# Altium schematic sheet VME_connectors.SchDoc: VME connectors
size 420 x 297 mm; CheckedBy: T.Janicki; Author: G.Kasprowicz; CompanyName: Creotech Instruments SA; DrawnBy: G.Kasprowicz; Organization: CERN; Address1: European Organization for Nuclear Research; Address2: CH-1211 Geneve 23 - Switzerland; Revision: -; SheetNumber: 18; SheetTotal: 21; EDA_Number: EDA-xxxx; Projet: Simple VME FMC Carrier; ModifiedBy: -; CreateDate: 26/04/2012; CheckedDate: 30/04/2012; DivGrp: BE-CO; Designer: G.Kasprowicz; PageSetup: Record=PageOptions|CenterHorizontal=True|CenterVertical=True|PrintScale=0.95|XCorrection=1.00|YCorrection=1.00|PrintKind=1|BorderSize=5000000|LeftOffset=0|BottomOffset=0|Orientation=2|PaperLength=1000|PaperWidth=1000|Scale=100|PaperSource=15|PrintQuality=600|MediaType=1|DitherType=10|PaperKind=A3|PrintScaleMode=1; ModifiedDate: -
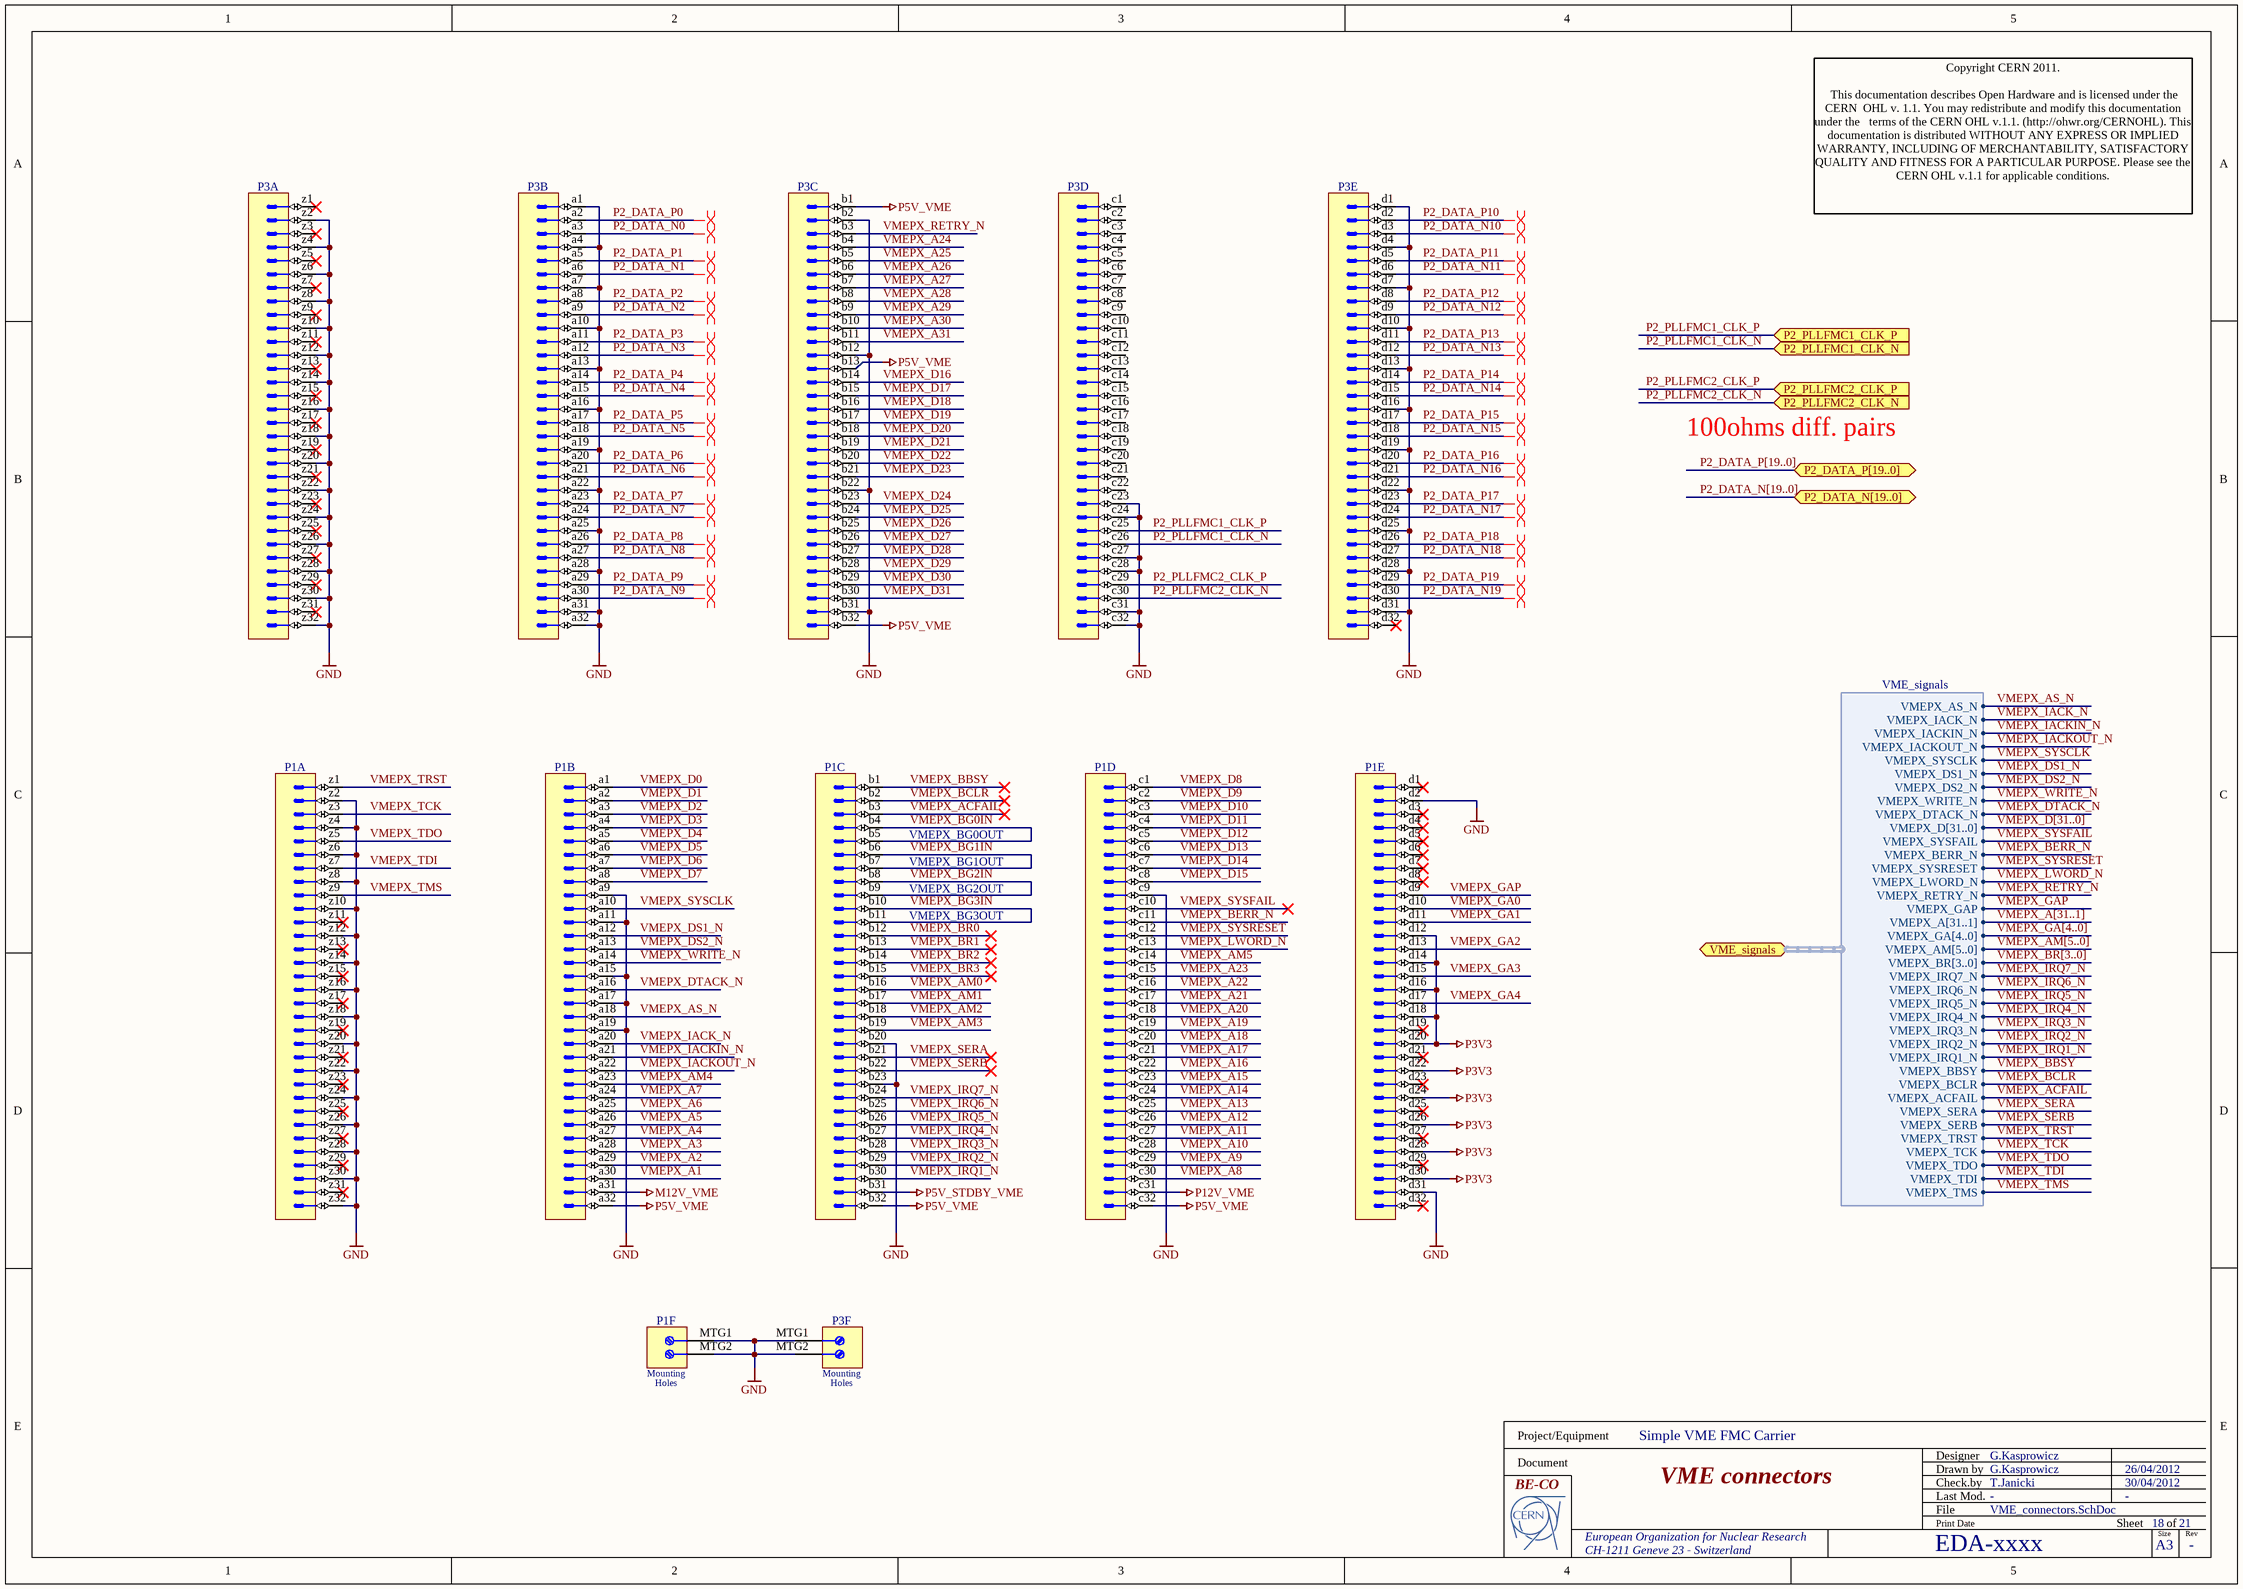
[diagram p0: VME_connectors.SchDoc]

## Parts
P1  HAR-BUS 64  [HARTING_02 01 160 2101]  (value not drawn)  (parts A,B,C,D,E,F of 6)
P3  HAR-BUS 64  [HARTING_02 01 160 2101]  (value not drawn)  (parts A,B,C,D,E,F of 6)

## Ports
P2_DATA_N[19..0] (bidir), P2_DATA_P[19..0] (bidir), P2_PLLFMC1_CLK_N (in), P2_PLLFMC1_CLK_P (in), P2_PLLFMC2_CLK_N (in), P2_PLLFMC2_CLK_P (in), VME_signals (harness VME_signals)

## Harnesses
VME_signals: VMEPX_AS_N, VMEPX_IACK_N, VMEPX_IACKIN_N, VMEPX_IACKOUT_N, VMEPX_SYSCLK, VMEPX_DS1_N, VMEPX_DS2_N, VMEPX_WRITE_N, VMEPX_DTACK_N, VMEPX_D[31..0], VMEPX_SYSFAIL, VMEPX_BERR_N, VMEPX_SYSRESET, VMEPX_LWORD_N, VMEPX_RETRY_N, VMEPX_GAP, VMEPX_A[31..1], VMEPX_GA[4..0], VMEPX_AM[5..0], VMEPX_BR[3..0], VMEPX_IRQ7_N, VMEPX_IRQ6_N, VMEPX_IRQ5_N, VMEPX_IRQ4_N, VMEPX_IRQ3_N, VMEPX_IRQ2_N, VMEPX_IRQ1_N, VMEPX_BBSY, VMEPX_BCLR, VMEPX_ACFAIL, VMEPX_SERA, VMEPX_SERB, VMEPX_TRST, VMEPX_TCK, VMEPX_TDO, VMEPX_TDI, VMEPX_TMS

## Nets
GND: P1.a9 P1.a11 P1.a15 P1.a17 P1.a19 P1.b20 P1.b23 P1.c9 P1.d2 P1.d31 P1.MTG1 P1.MTG2 P1.z2 P1.z4 P1.z6 P1.z8 P1.z10 P1.z12 P1.z14 P1.z16 P1.z18 P1.z20 P1.z22 P1.z24 P1.z26 P1.z28 P1.z30 P1.z32 P3.a1 P3.a4 P3.a7 P3.a10 P3.a13 P3.a16 P3.a19 P3.a22 P3.a25 P3.a28 P3.a31 P3.a32 P3.b2 P3.b12 P3.b22 P3.b31 P3.c23 P3.c24 P3.c27 P3.c28 P3.c31 P3.c32 P3.d1 P3.d4 P3.d7 P3.d10 P3.d13 P3.d16 P3.d19 P3.d22 P3.d25 P3.d28 P3.d31 P3.MTG1 P3.MTG2 P3.z2 P3.z4 P3.z6 P3.z8 P3.z10 P3.z12 P3.z14 P3.z16 P3.z18 P3.z20 P3.z22 P3.z24 P3.z26 P3.z28 P3.z30 P3.z32
M12V_VME: P1.a31
P3V3: P1.d12 P1.d14 P1.d16 P1.d18 P1.d20 P1.d22 P1.d24 P1.d26 P1.d28 P1.d30
P5V_STDBY_VME: P1.b31
P5V_VME: P1.a32 P1.b32 P1.c32 P3.b1 P3.b13 P3.b32
P12V_VME: P1.c31
P2_DATA_N0: P3.a3
P2_DATA_N1: P3.a6
P2_DATA_N2: P3.a9
P2_DATA_N3: P3.a12
P2_DATA_N4: P3.a15
P2_DATA_N5: P3.a18
P2_DATA_N6: P3.a21
P2_DATA_N7: P3.a24
P2_DATA_N8: P3.a27
P2_DATA_N9: P3.a30
P2_DATA_N10: P3.d3
P2_DATA_N11: P3.d6
P2_DATA_N12: P3.d9
P2_DATA_N13: P3.d12
P2_DATA_N14: P3.d15
P2_DATA_N15: P3.d18
P2_DATA_N16: P3.d21
P2_DATA_N17: P3.d24
P2_DATA_N18: P3.d27
P2_DATA_N19: P3.d30
P2_DATA_P0: P3.a2
P2_DATA_P1: P3.a5
P2_DATA_P2: P3.a8
P2_DATA_P3: P3.a11
P2_DATA_P4: P3.a14
P2_DATA_P5: P3.a17
P2_DATA_P6: P3.a20
P2_DATA_P7: P3.a23
P2_DATA_P8: P3.a26
P2_DATA_P9: P3.a29
P2_DATA_P10: P3.d2
P2_DATA_P11: P3.d5
P2_DATA_P12: P3.d8
P2_DATA_P13: P3.d11
P2_DATA_P14: P3.d14
P2_DATA_P15: P3.d17
P2_DATA_P16: P3.d20
P2_DATA_P17: P3.d23
P2_DATA_P18: P3.d26
P2_DATA_P19: P3.d29
P2_PLLFMC1_CLK_N: P3.c26 ; port P2_PLLFMC1_CLK_N
P2_PLLFMC1_CLK_P: P3.c25 ; port P2_PLLFMC1_CLK_P
P2_PLLFMC2_CLK_N: P3.c30 ; port P2_PLLFMC2_CLK_N
P2_PLLFMC2_CLK_P: P3.c29 ; port P2_PLLFMC2_CLK_P
VMEPX_A1: P1.a30
VMEPX_A2: P1.a29
VMEPX_A3: P1.a28
VMEPX_A4: P1.a27
VMEPX_A5: P1.a26
VMEPX_A6: P1.a25
VMEPX_A7: P1.a24
VMEPX_A8: P1.c30
VMEPX_A9: P1.c29
VMEPX_A10: P1.c28
VMEPX_A11: P1.c27
VMEPX_A12: P1.c26
VMEPX_A13: P1.c25
VMEPX_A14: P1.c24
VMEPX_A15: P1.c23
VMEPX_A16: P1.c22
VMEPX_A17: P1.c21
VMEPX_A18: P1.c20
VMEPX_A19: P1.c19
VMEPX_A20: P1.c18
VMEPX_A21: P1.c17
VMEPX_A22: P1.c16
VMEPX_A23: P1.c15
VMEPX_A24: P3.b4
VMEPX_A25: P3.b5
VMEPX_A26: P3.b6
VMEPX_A27: P3.b7
VMEPX_A28: P3.b8
VMEPX_A29: P3.b9
VMEPX_A30: P3.b10
VMEPX_A31: P3.b11
VMEPX_ACFAIL: P1.b3 ; port VME_signals.VMEPX_ACFAIL
VMEPX_AM0: P1.b16
VMEPX_AM1: P1.b17
VMEPX_AM2: P1.b18
VMEPX_AM3: P1.b19
VMEPX_AM4: P1.a23
VMEPX_AM5: P1.c14
VMEPX_AS_N: P1.a18 ; port VME_signals.VMEPX_AS_N
VMEPX_BBSY: P1.b1 ; port VME_signals.VMEPX_BBSY
VMEPX_BCLR: P1.b2 ; port VME_signals.VMEPX_BCLR
VMEPX_BERR_N: P1.c11 ; port VME_signals.VMEPX_BERR_N
VMEPX_BG0IN: P1.b4 P1.b5
VMEPX_BG1IN: P1.b6 P1.b7
VMEPX_BG2IN: P1.b8 P1.b9
VMEPX_BG3IN: P1.b10 P1.b11
VMEPX_BR0: P1.b12
VMEPX_BR1: P1.b13
VMEPX_BR2: P1.b14
VMEPX_BR3: P1.b15
VMEPX_D0: P1.a1
VMEPX_D1: P1.a2
VMEPX_D2: P1.a3
VMEPX_D3: P1.a4
VMEPX_D4: P1.a5
VMEPX_D5: P1.a6
VMEPX_D6: P1.a7
VMEPX_D7: P1.a8
VMEPX_D8: P1.c1
VMEPX_D9: P1.c2
VMEPX_D10: P1.c3
VMEPX_D11: P1.c4
VMEPX_D12: P1.c5
VMEPX_D13: P1.c6
VMEPX_D14: P1.c7
VMEPX_D15: P1.c8
VMEPX_D16: P3.b14
VMEPX_D17: P3.b15
VMEPX_D18: P3.b16
VMEPX_D19: P3.b17
VMEPX_D20: P3.b18
VMEPX_D21: P3.b19
VMEPX_D22: P3.b20
VMEPX_D23: P3.b21
VMEPX_D24: P3.b23
VMEPX_D25: P3.b24
VMEPX_D26: P3.b25
VMEPX_D27: P3.b26
VMEPX_D28: P3.b27
VMEPX_D29: P3.b28
VMEPX_D30: P3.b29
VMEPX_D31: P3.b30
VMEPX_DS1_N: P1.a12 ; port VME_signals.VMEPX_DS1_N
VMEPX_DS2_N: P1.a13 ; port VME_signals.VMEPX_DS2_N
VMEPX_DTACK_N: P1.a16 ; port VME_signals.VMEPX_DTACK_N
VMEPX_GA0: P1.d10
VMEPX_GA1: P1.d11
VMEPX_GA2: P1.d13
VMEPX_GA3: P1.d15
VMEPX_GA4: P1.d17
VMEPX_GAP: P1.d9 ; port VME_signals.VMEPX_GAP
VMEPX_IACK_N: P1.a20 ; port VME_signals.VMEPX_IACK_N
VMEPX_IACKIN_N: P1.a21 ; port VME_signals.VMEPX_IACKIN_N
VMEPX_IACKOUT_N: P1.a22 ; port VME_signals.VMEPX_IACKOUT_N
VMEPX_IRQ1_N: P1.b30 ; port VME_signals.VMEPX_IRQ1_N
VMEPX_IRQ2_N: P1.b29 ; port VME_signals.VMEPX_IRQ2_N
VMEPX_IRQ3_N: P1.b28 ; port VME_signals.VMEPX_IRQ3_N
VMEPX_IRQ4_N: P1.b27 ; port VME_signals.VMEPX_IRQ4_N
VMEPX_IRQ5_N: P1.b26 ; port VME_signals.VMEPX_IRQ5_N
VMEPX_IRQ6_N: P1.b25 ; port VME_signals.VMEPX_IRQ6_N
VMEPX_IRQ7_N: P1.b24 ; port VME_signals.VMEPX_IRQ7_N
VMEPX_LWORD_N: P1.c13 ; port VME_signals.VMEPX_LWORD_N
VMEPX_RETRY_N: P3.b3 ; port VME_signals.VMEPX_RETRY_N
VMEPX_SERA: P1.b21 ; port VME_signals.VMEPX_SERA
VMEPX_SERB: P1.b22 ; port VME_signals.VMEPX_SERB
VMEPX_SYSCLK: P1.a10 ; port VME_signals.VMEPX_SYSCLK
VMEPX_SYSFAIL: P1.c10 ; port VME_signals.VMEPX_SYSFAIL
VMEPX_SYSRESET: P1.c12 ; port VME_signals.VMEPX_SYSRESET
VMEPX_TCK: P1.z3 ; port VME_signals.VMEPX_TCK
VMEPX_TDI: P1.z7 ; port VME_signals.VMEPX_TDI
VMEPX_TDO: P1.z5 ; port VME_signals.VMEPX_TDO
VMEPX_TMS: P1.z9 ; port VME_signals.VMEPX_TMS
VMEPX_TRST: P1.z1 ; port VME_signals.VMEPX_TRST
VMEPX_WRITE_N: P1.a14 ; port VME_signals.VMEPX_WRITE_N

Not connected (* = marked no-connect by the designer): P1 d1* d3* d4* d5* d6* d7* d8* d19* d21* d23* d25* d27* d29* d32* z11* z13* z15* z17* z19* z21* z23* z25* z27* z29* z31*; P3 c1 c2 c3 c4 c5 c6 c7 c8 c9 c10 c11 c12 c13 c14 c15 c16 c17 c18 c19 c20 c21 c22 d32* z1* z3* z5* z7* z9* z11* z13* z15* z17* z19* z21* z23* z25* z27* z29* z31*

## Buses and harness runs
bus P2_DATA_N[19..0] = port P2_DATA_N[19..0]
bus P2_DATA_P[19..0] = port P2_DATA_P[19..0]
bus VMEPX_A[31..1]
bus VMEPX_AM[5..0]
bus VMEPX_BR[3..0]
bus VMEPX_D[31..0]
bus VMEPX_GA[4..0]

## Layout directives
differential pair: P2_DATA_N0, P2_DATA_N1, P2_DATA_N2, P2_DATA_N3, P2_DATA_N4, P2_DATA_N5, P2_DATA_N6, P2_DATA_N7, P2_DATA_N8, P2_DATA_N9, P2_DATA_N10, P2_DATA_N11, P2_DATA_N12, P2_DATA_N13, P2_DATA_N14, P2_DATA_N15, P2_DATA_N16, P2_DATA_N17, P2_DATA_N18, P2_DATA_N19, P2_DATA_P0, P2_DATA_P1, P2_DATA_P2, P2_DATA_P3, P2_DATA_P4, P2_DATA_P5, P2_DATA_P6, P2_DATA_P7, P2_DATA_P8, P2_DATA_P9, P2_DATA_P10, P2_DATA_P11, P2_DATA_P12, P2_DATA_P13, P2_DATA_P14, P2_DATA_P15, P2_DATA_P16, P2_DATA_P17, P2_DATA_P18, P2_DATA_P19

## Notes on the sheet
- Copyright CERN 2011.
  This documentation describes Open Hardware and is licensed under the CERN  OHL v. 1.1. You may redistribute and modify this documentation under the   terms of the CERN OHL v.1.1. (http://ohwr.org/CERNOHL). This  documentation is distributed WITHOUT ANY EXPRESS OR IMPLIED  WARRANTY, INCLUDING OF MERCHANTABILITY, SATISFACTORY  QUALITY AND FITNESS FOR A PARTICULAR PURPOSE. Please see the  CERN OHL v.1.1 for applicable conditions.
- 100ohms diff. pairs
- VMEPX_BG0OUT
- VMEPX_BG1OUT
- VMEPX_BG2OUT
- VMEPX_BG3OUT
- Project/Equipment
- Document
- Designer
- Drawn by
- Check.by
- File
- Last Mod.
- Print Date
- Sheet
- Size
- A3
- of
- Rev
- (in symbol HARTING_02 01 160 2101, part F) Mounting; Holes

## Library data of the parts
P1 P3 = HARTING_02 01 160 2101: Connector 160zabcd Male (5x32); Part Description: DIN 41612, har-bus 64, 160 poles,5 Rows z+a+b+c+d, Angled solder pins, Male contacts, Pitch 2.54mm; Part Number: HARTING_02 01 160 2101; Component Kind: Standard; Component Type: Standard; Pin Count: 162; Family: HAR-BUS 64; Mounted: Yes; Socket: No; SMD: No; Manufacturer: HARTING; Manufacturer Part Number: 02 01 160 2101; ComponentHeight: 11.1mm; HelpURL: \\cern.ch\dfs\Applications\Altium\Datasheets\HARTING_02 01 160 2101.pdf; Author: CERN DEM JLC; CreateDate: 26/11/2008; LatestRevisionDate: 26/11/2008; Table: HARTING